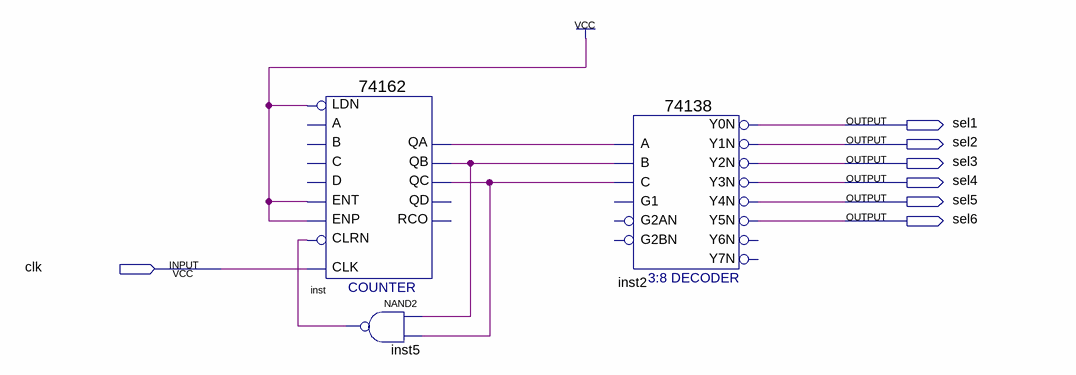
[diagram p0: schematic sheet]
// Quartus schematic sel.bdf as structural Verilog: 3 symbols, 7 pins
module sel (
  input  clk,
  output sel1,
  output sel2,
  output sel3,
  output sel4,
  output sel5,
  output sel6
);

  wire inst5_out, inst_qa, inst_qb, inst_qc;

  \74162  inst (
    .LDN(1'b1), .ENP(1'b1), .ENT(1'b1), .CLRN(inst5_out), .CLK(clk), .QA(inst_qa), .QB(inst_qb), .QC(inst_qc));  // open: A, B, C, D, QD, RCO
  nand inst5 (inst5_out, inst_qb, inst_qc);
  \74138  inst2 (
    .A(inst_qa), .B(inst_qb), .C(inst_qc), .Y0N(sel1), .Y1N(sel2), .Y2N(sel3), .Y3N(sel4), .Y4N(sel5),
    .Y5N(sel6));  // open: G1, G2AN, G2BN, Y6N, Y7N
endmodule
